# EAGLE design boattery_board (EAGLE 9.6.2)
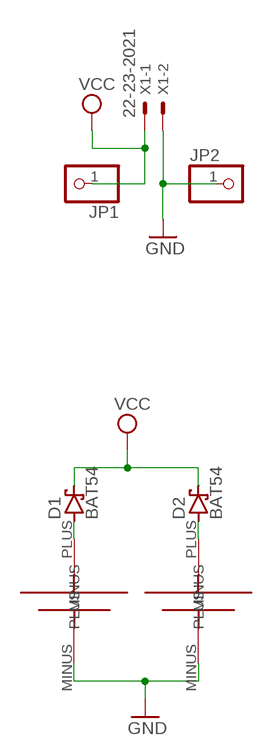
[diagram p0: schematic, sheet 1]

## Parts
D1  BAT54  [SOT23]
D2  BAT54  [SOT23]
JP1  PINHD-1X1  [1X01]
JP2  PINHD-1X1  [1X01]
U$1  KEYSTONE_1018  [KEYSTONE_1018_HOLDER]
U$2  KEYSTONE_1018  [KEYSTONE_1018_HOLDER]
X1  22-23-2021  [22-23-2021]

## Nets
GND: JP2.1 U$1.MINUS U$2.MINUS X1.2
N$3: D1.1(A) U$1.PLUS
N$4: D2.1(A) U$2.PLUS
VCC: D1.3(C) D2.3(C) JP1.1 X1.1

## Library data of the parts
D1 D2 = diode:BAT54: Schottky Diodes Source: Fairchild .. BAT54.pdf
JP1 JP2 = pinhead:PINHD-1X1: PIN HEADER
U$1 U$2 = batteries:KEYSTONE_1018
X1 = con-molex:22-23-2021: .100" (2.54mm) Center Header - 2 Pin; MF: MOLEX; MPN: 22-23-2021; OC_FARNELL: 1462926; OC_NEWARK: 25C3832

## Board
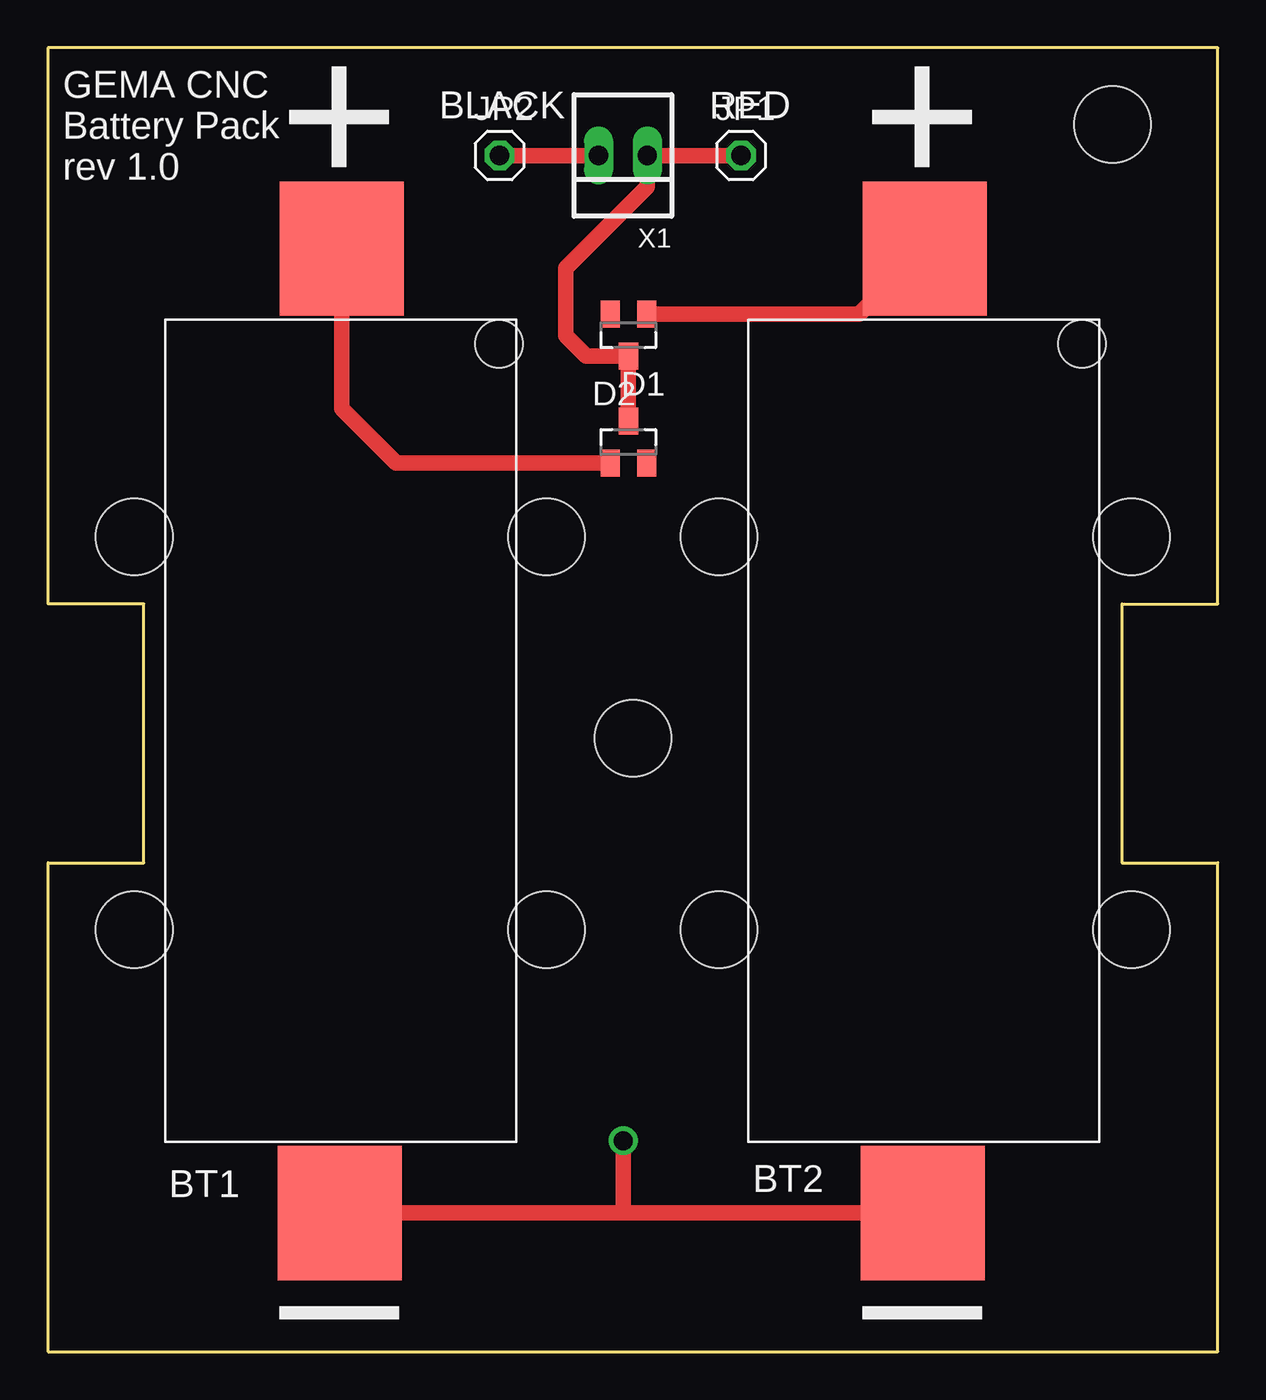
[diagram p1: board, top side]
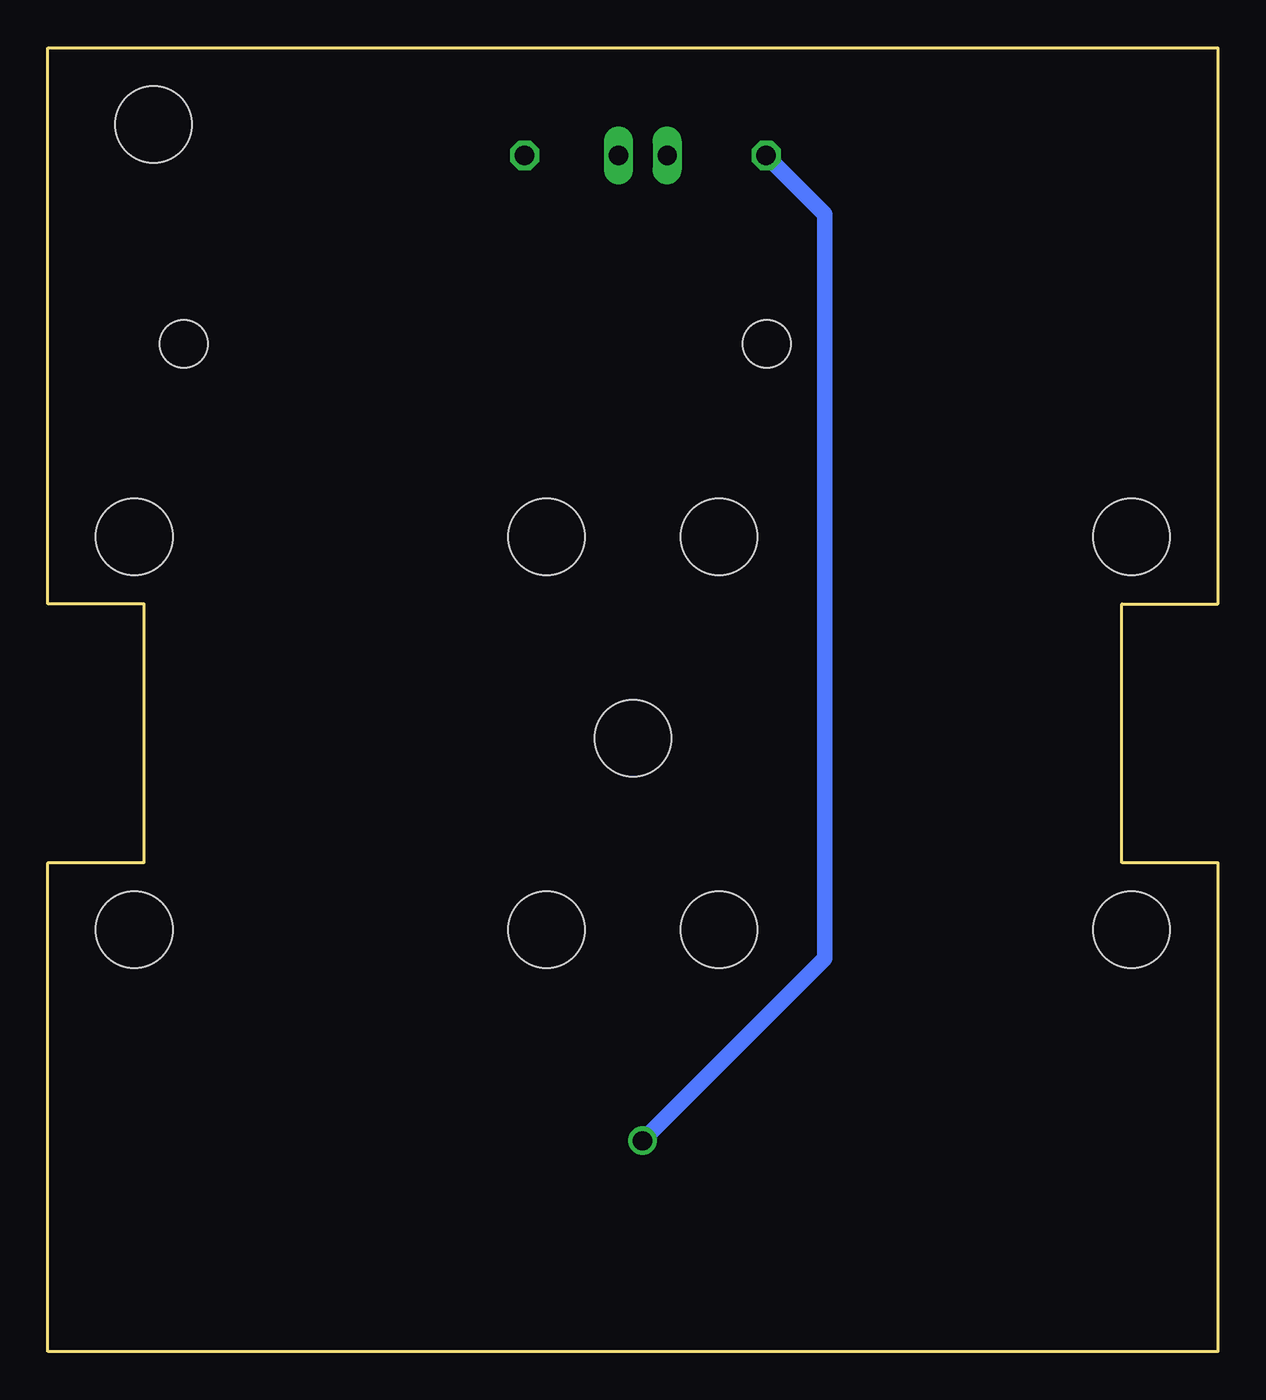
[diagram p2: board, bottom side, seen from below]

Size 61 x 68 mm. Coordinates in mm from the lower left corner, seen from the top.
Outline: 0,0 61,0 61,25.5 56,25.5 56,39 61,39 61,68 0,68 0,39 5,39 5,25.5 0,25.5 0,0
Copper layers (1*16): Top 0.035mm / dielectric 1.5mm / Bottom 0.035mm
Design rules "default": minimum track width 6mil, minimum drill 0.35mm, track to track 6mil, track to pad 6mil, pad to pad 6mil, via to via 6mil, smd to smd 6mil, copper to edge 40mil, drill to drill 6mil, minimum pad ring 10mil, minimum via ring 8mil, stop-mask expansion 4mil, vias tented up to drill 0mil, thermal gap 10mil
Holes 4 mm at 55.5,64 4.5,42.5 4.5,22 26,42.5 26,22 35,22 35,42.5 30.5,32 56.5,42.5 56.5,22

### Footprints (pad centres in the part's own frame; a part is rotated, then mirrored left to right if it is on the bottom)
SOT23 = smd 1 x 1.4: 1 -0.95,-1.1; 2 0.95,-1.1; 3 0,1.1
1X01 = drill 1.016 octagon: 1 0,0
KEYSTONE_1018_HOLDER = smd 6.452 x 7: MINUS 9.1,-3.7; PLUS 9.2,46.6 | hole 2.5: 17.4,41.63
22-23-2021 = drill 1 long: 1 -1.27,0; 2 1.27,0

### Placement (x,y rotation side)
D1  30.27,53.02 180 top
D2  30.27,47.44 0 top
JP1  36.14,62.39 0 top
JP2  23.55,62.39 0 top
U$1  36.52,10.93 0 top
U$2  6.12,10.93 0 top
X1  29.98,62.39 180 top

### Tracks (layer width: path | path; a pad name or v marks a point on that pad's centre or on a via)
GND  (via drill 1)
  Top 0.813: X1.2 JP2.1 | U$2.MINUS 30,7.23 | 30,7.23 U$1.MINUS | v30,11 30,7.23
  Bottom 0.813: JP2.1 20.5,59.34 20.5,20.5 v30,11
N$3
  Top 0.813: D1.1 42.31,54.12 U$1.PLUS
N$4
  Top 0.813: U$2.PLUS 15.32,49.18 18.16,46.34 D2.1
VCC
  Top 0.813: D2.3 D1.3 28.08,51.92 27,53 27,56.5 31.25,60.75 X1.1 JP1.1

### Text on the board
tPlace: BLACK | RED | GEMA CNC / Battery Pack / rev 1.0 | BT1 | BT2
Measures: BATTERY / PACK